# Altium project PCB_Project1.PrjPCB
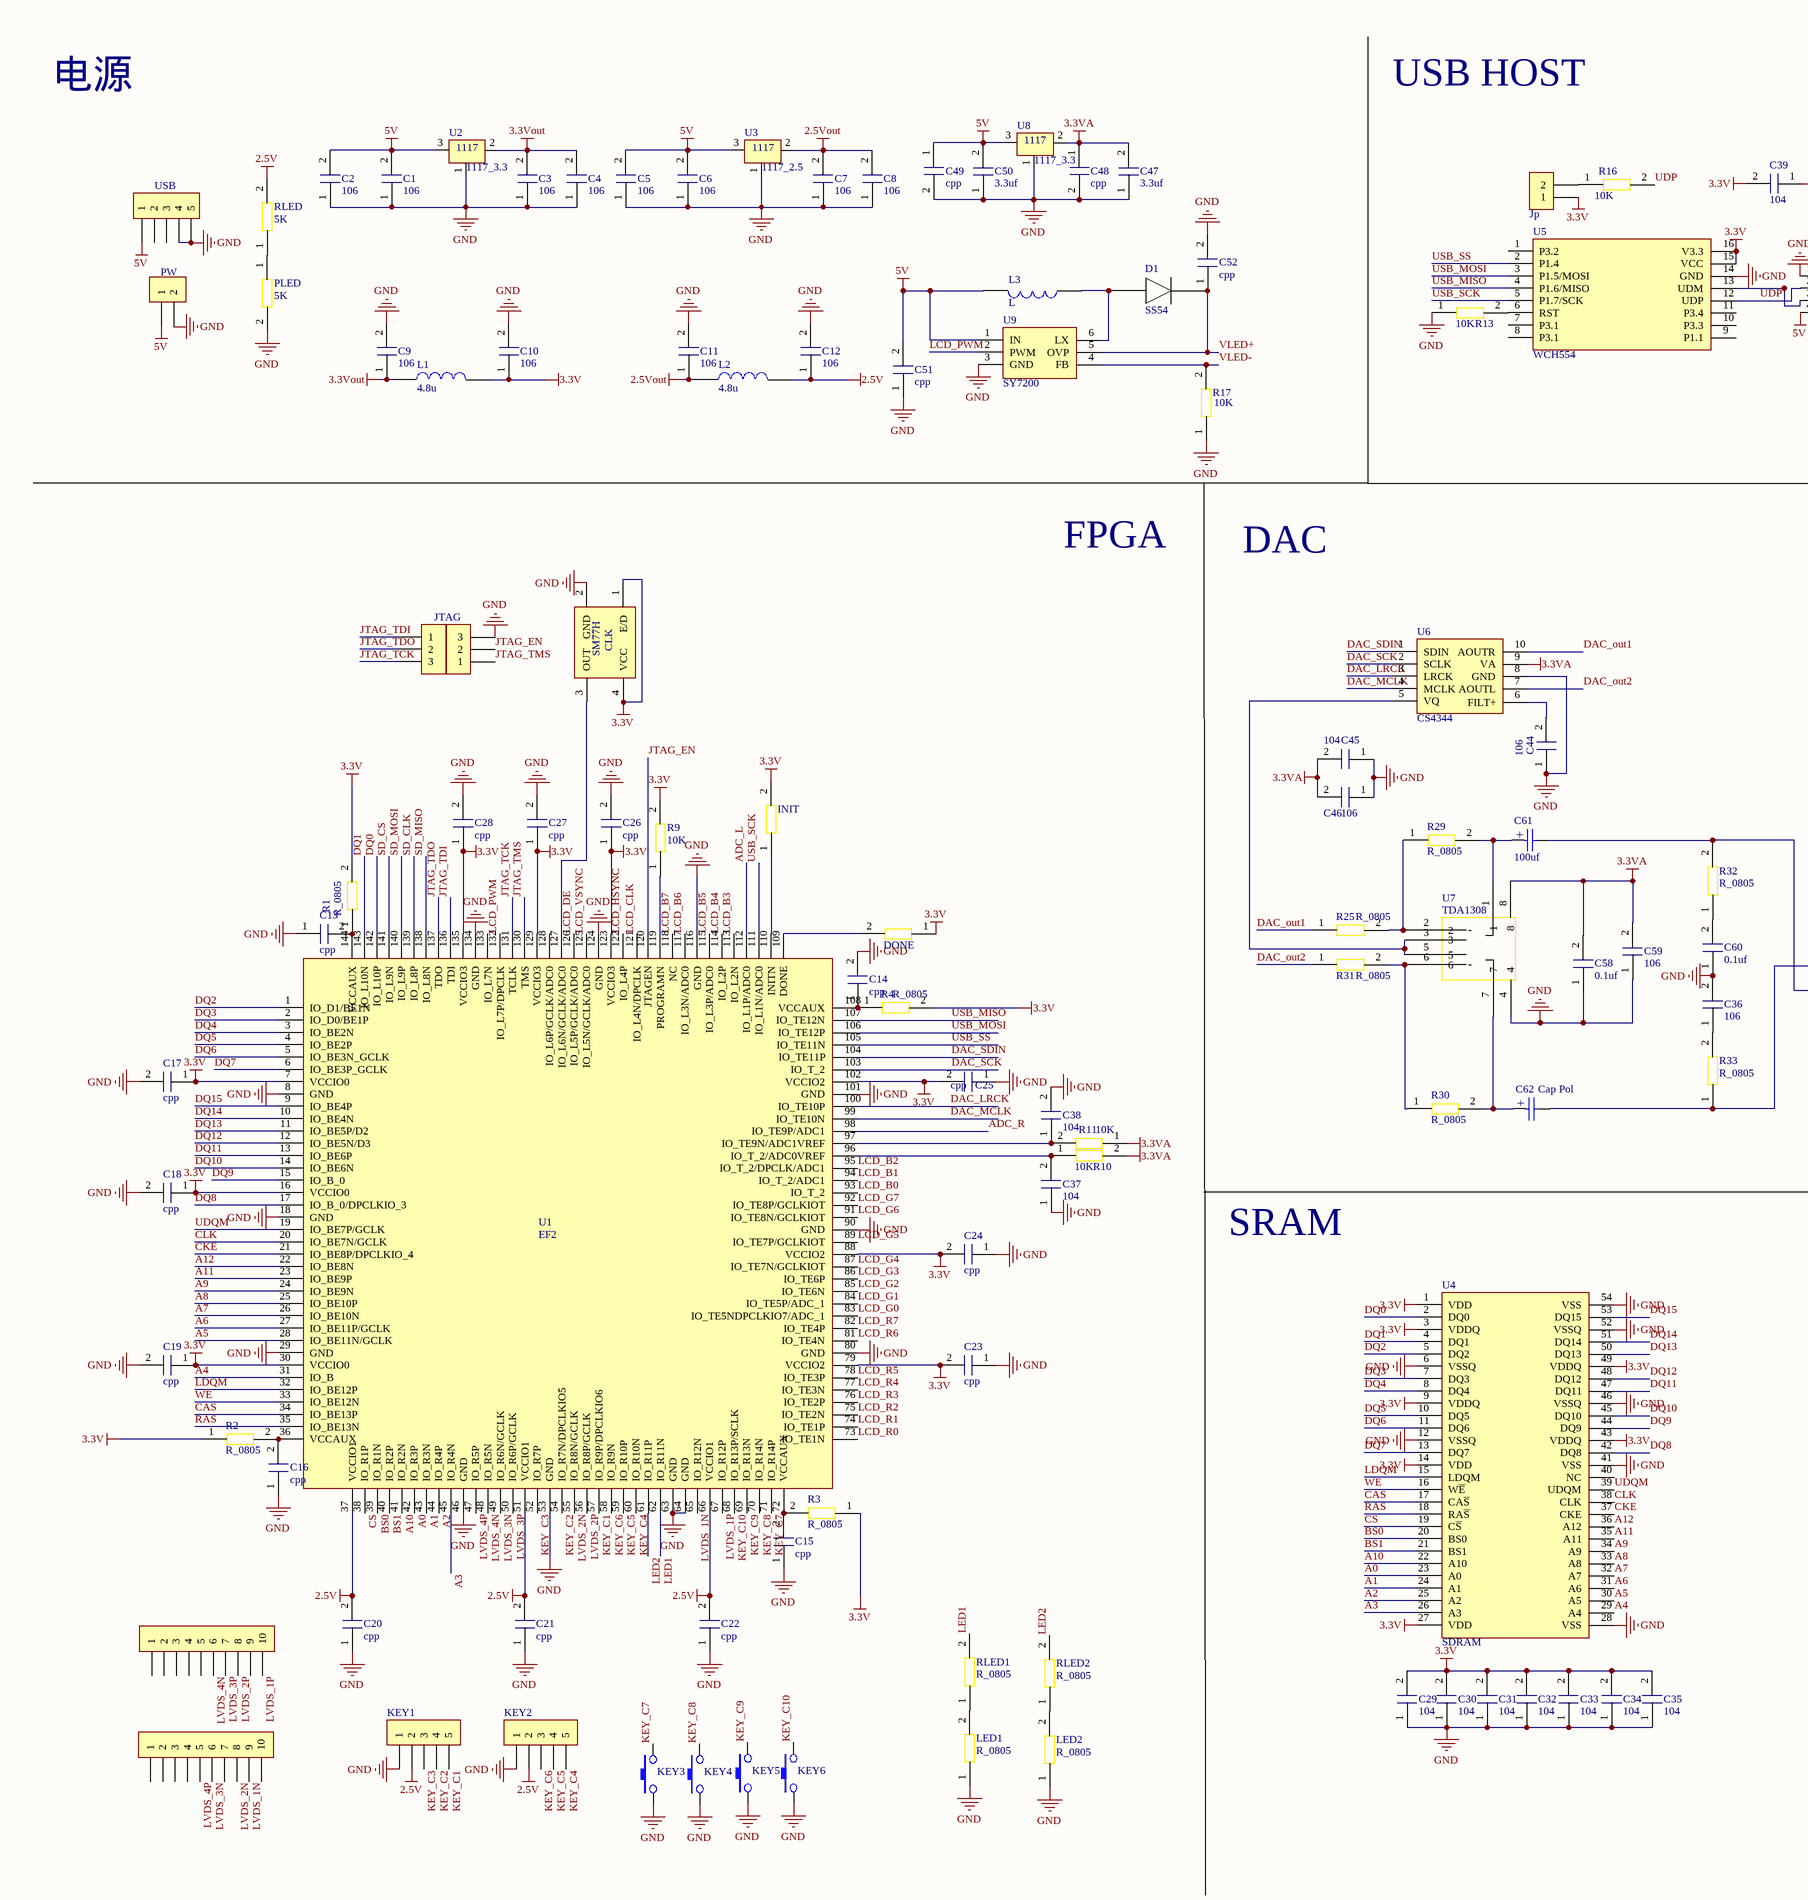
[diagram p0: Sheet1.SchDoc, left]
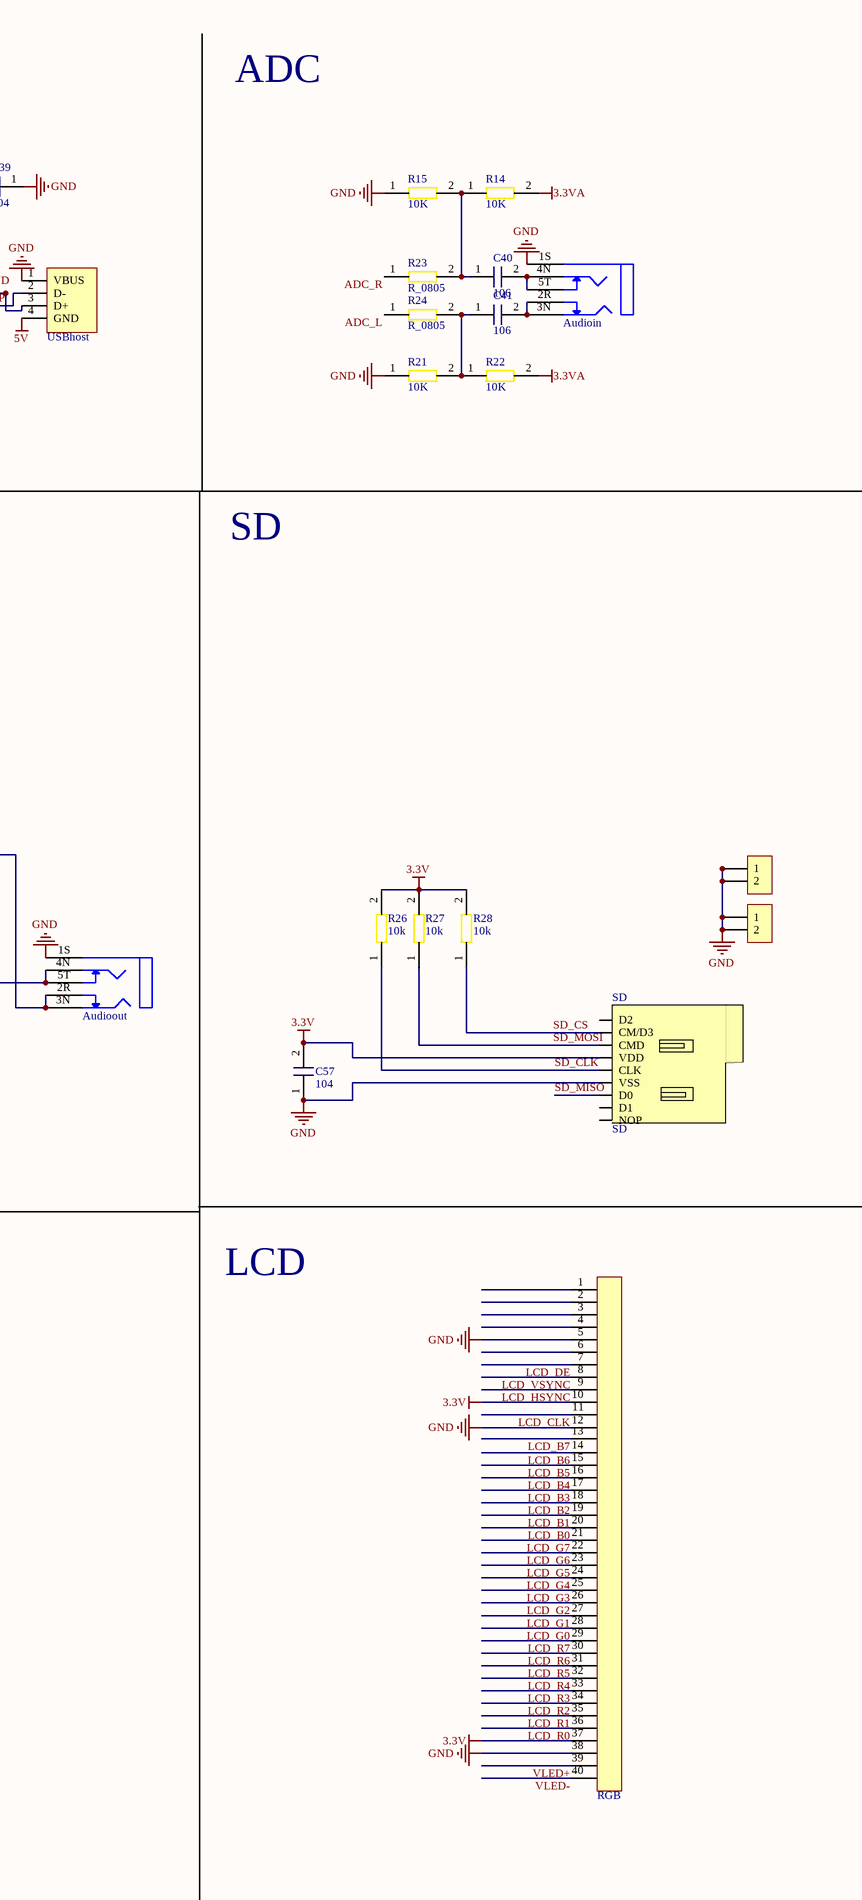
[diagram p1: Sheet1.SchDoc, right]
1 sheet, 123 parts. Net scope: global (net labels, ports and power ports of the same name join across sheets).
Board file: PCB1.PcbDoc

## Sheet Sheet1.SchDoc
size A2

### Parts
Audioin  Audio  [AUDIO]  (value not drawn)
Audioout  Audio  [AUDIO]  (value not drawn)
brg  CON10  [sip10]  (value not drawn)
brg1  CON10  [sip10]  (value not drawn)
brg2  CON2  [SIP2]  (value not drawn)
brg4  CON2  [SIP2]  (value not drawn)
C1  106  [电容器]
C2  106  [电容器]
C3  106  [电容器]
C4  106  [电容器]
C5  106  [电容器]
C6  106  [电容器]
C7  106  [电容器]
C8  106  [电容器]
C9  106  [电容器]
C10  106  [电容器]
C11  106  [电容器]
C12  106  [电容器]
C13  cpp  [电容器]
C14  cpp  [电容器]
C15  cpp  [电容器]
C16  cpp  [电容器]
C17  cpp  [电容器]
C18  cpp  [电容器]
C19  cpp  [电容器]
C20  cpp  [电容器]
C21  cpp  [电容器]
C22  cpp  [电容器]
C23  cpp  [电容器]
C24  cpp  [电容器]
C25  cpp  [电容器]
C26  cpp  [电容器]
C27  cpp  [电容器]
C28  cpp  [电容器]
C29  104  [电容器]
C30  104  [电容器]
C31  104  [电容器]
C32  104  [电容器]
C33  104  [电容器]
C34  104  [电容器]
C35  104  [电容器]
C36  106  [电容器]
C37  104  [电容器]
C38  104  [电容器]
C39  104  [电容器]
C40  106  [电容器]
C41  106  [电容器]
C44  106  [电容器]
C45  104  [电容器]
C46  106  [电容器]
C47  3.3uf  [电容器]
C48  cpp  [电容器]
C49  cpp  [电容器]
C50  3.3uf  [电容器]
C51  cpp  [电容器]
C52  cpp  [电容器]
C57  104  [电容器]
C58  0.1uf  [电容器]
C59  106  [电容器]
C60  0.1uf  [电容器]
C61  100uf  [RB.1/.2]
C62  Cap Pol  [RB.1/.2]
CLK  SM77H  [SM77H]
D1  SS54  [SS54 - duplicate]
DONE  (no value)  [R_0805]
INIT  (no value)  [R_0805]
Jp  CON2  [SIP2]  (value not drawn)
JTAG  CON3  [SIP3]  (value not drawn)
JTAG2  CON3  [SIP3]  (value not drawn)
KEY1  CON5  [SIP5]  (value not drawn)
KEY2  CON5  [SIP5]  (value not drawn)
KEY3  KEY  [AN66]  (value not drawn)
KEY4  KEY  [AN66]  (value not drawn)
KEY5  KEY  [AN66]  (value not drawn)
KEY6  KEY  [AN66]  (value not drawn)
L1  4.8u  [L]
L2  4.8u  [L]
L3  L  [L]
LED1  R_0805  [R_0805]
LED2  R_0805  [R_0805]
PLED  5K  [R_0805]
PW  CON2  [SIP2]  (value not drawn)
R1  R_0805  [R_0805]
R2  R_0805  [R_0805]
R3  R_0805  [R_0805]
R4  R_0805  [R_0805]
R9  10K  [R_0805]
R10  10K  [R_0805]
R11  10K  [R_0805]
R13  10K  [R_0805]
R14  10K  [R_0805]
R15  10K  [R_0805]
R16  10K  [R_0805]
R17  10K  [R_0805]
R21  10K  [R_0805]
R22  10K  [R_0805]
R23  R_0805  [R_0805]
R24  R_0805  [R_0805]
R25  R_0805  [R_0805]
R26  10k  [R_0805]
R27  10k  [R_0805]
R28  10k  [R_0805]
R29  R_0805  [R_0805]
R30  R_0805  [R_0805]
R31  R_0805  [R_0805]
R32  R_0805  [R_0805]
R33  R_0805  [R_0805]
RGB  PFC_40PIN  [FPC_40PIN]  (value not drawn)
RLED  5K  [R_0805]
RLED1  R_0805  [R_0805]
RLED2  R_0805  [R_0805]
SD  SD  [TF卡座]
U1  EF2  [LQFP_EF2]
U2  1117_3.3  [SOT230P700X180-4N]
U3  1117_2.5  [SOT230P700X180-4N]
U4  SDRAM  [SDRAM]
U5  WCH554  [WCH554G]
U6  CS4344  [SSOP10 _CS4344]
U7  TDA1308  [TDA1308]
U8  1117_3.3  [SOT230P700X180-4N]
U9  SY7200  [SOT23-6N]
USB  USB  [micro-USB]  (value not drawn)
USBhost  USBhost  [USB-H]  (value not drawn)

### Nets
2.5V: C12.1(c) C20.2(c+) C21.2(c+) C22.2(c+) KEY1.2 KEY2.2 L2.1 RLED.2 U1.37(VCCIO1) U1.51(VCCIO1) U1.66(VCCIO1)
2.5Vout: C7.2(c+) C8.2(c+) C11.1(c) L2.2 U3.2(OUT)
3.3V: C10.1(c) C17.1(c) C18.1(c) C19.1(c) C23.2(c+) C24.2(c+) C25.2(c+) C26.1(c) C27.1(c) C28.1(c) C29.2(c+) C30.2(c+) C31.2(c+) C32.2(c+) C33.2(c+) C34.2(c+) C35.2(c+) C39.2(c+) C57.2(c+) CLK.1(E/D) CLK.4(VCC) DONE.1 INIT.2 Jp.1 L1.1 R1.2 R2.1 R3.1 R4.2 R9.2 R26.2 R27.2 R28.2 RGB.10 RGB.37 SD.4(VDD) U1.7(VCCIO0) U1.16(VCCIO0) U1.30(VCCIO0) U1.79(VCCIO2) U1.88(VCCIO2) U1.102(VCCIO2) U1.123(VCCIO3) U1.129(VCCIO3) U1.135(VCCIO3) U4.1(VDD) U4.3(VDDQ) U4.9(VDDQ) U4.14(VDD) U4.27(VDD) U4.43(VDDQ) U4.49(VDDQ) U5.15(VCC) U5.16(V3.3)
3.3VA: C45.2(c+) C46.2(c+) C47.2(c+) C48.1(c) C58.2(c+) C59.2(c+) R10.2 R11.1 R14.2 R22.2 U6.9(VA) U7.8 U8.2(OUT)
3.3Vout: C3.2(c+) C4.2(c+) C9.1(c) L1.2 U2.2(OUT)
5V: C1.2(c+) C2.2(c+) C5.2(c+) C6.2(c+) C49.1(c) C50.2(c+) C51.2(c+) L3.1 PW.1 U2.3(IN) U3.3(IN) U8.3(IN) U9.1(IN) USB.1 USBhost.4(GND)
GND: Audioin.1S Audioout.1S brg2.1 brg2.2 brg4.1 brg4.2 C1.1(c) C2.1(c) C3.1(c) C4.1(c) C5.1(c) C6.1(c) C7.1(c) C8.1(c) C9.2(c+) C10.2(c+) C11.2(c+) C12.2(c+) C13.1(c) C14.2(c+) C15.1(c) C16.1(c) C17.2(c+) C18.2(c+) C19.2(c+) C20.1(c) C21.1(c) C22.1(c) C23.1(c) C24.1(c) C25.1(c) C26.2(c+) C27.2(c+) C28.2(c+) C29.1(c) C30.1(c) C31.1(c) C32.1(c) C33.1(c) C34.1(c) C35.1(c) C36.2(c+) C37.1(c) C38.2(c+) C39.1(c) C44.1(c) C45.1(c) C46.1(c) C47.1(c) C48.2(c+) C49.2(c+) C50.1(c) C51.1(c) C52.2(c+) C57.1(c) C58.1(c) C59.1(c) C60.1(c) CLK.2(GND) JTAG2.3 KEY1.1 KEY2.1 KEY3.1 KEY4.1 KEY5.1 KEY6.1 LED1.1 LED2.1 PLED.2 PW.2 R13.1 R15.1 R17.1 R21.1 RGB.5 RGB.12 RGB.38 SD.6(VSS) U1.8(GND) U1.18(GND) U1.29(GND) U1.46(GND) U1.53(GND) U1.63(GND) U1.64(GND) U1.80(GND) U1.90(GND) U1.101(GND) U1.116(GND) U1.124(GND) U1.134(GND) U2.1(ADJ) U3.1(ADJ) U4.6(VSSQ) U4.12(VSSQ) U4.28(VSS) U4.41(VSS) U4.46(VSSQ) U4.52(VSSQ) U4.54(VSS) U5.14(GND) U6.8(GND) U7.4 U8.1(ADJ) U9.3(GND) USB.4 USB.5 USBhost.1(VBUS)
A0: U1.42(IO_R3P) U4.23(A0)
A1: U1.43(IO_R3N) U4.24(A1)
A2: U1.44(IO_R4P) U4.25(A2)
A3: U1.45(IO_R4N) U4.26(A3)
A4: U1.31(IO_B) U4.29(A4)
A5: U1.28(IO_BE11N/GCLK) U4.30(A5)
A6: U1.27(IO_BE11P/GCLK) U4.31(A6)
A7: U1.26(IO_BE10N) U4.32(A7)
A8: U1.25(IO_BE10P) U4.33(A8)
A9: U1.24(IO_BE9N) U4.34(A9)
A10: U1.41(IO_R2N) U4.22(A10)
A11: U1.23(IO_BE9P) U4.35(A11)
A12: U1.22(IO_BE8N) U4.36(A12)
ADC_L: R24.1 U1.112(IO_L1P/ADC0)
ADC_R: R23.1 U1.98(IO_TE9P/ADC1)
BS0: U1.39(IO_R1N) U4.20(BS0)
BS1: U1.40(IO_R2P) U4.21(BS1)
CAS: U1.34(IO_BE13P) U4.17(CA~{S})
CKE: U1.21(IO_BE8P/DPCLKIO_4) U4.37(CKE)
CLK: U1.20(IO_BE7N/GCLK) U4.38(CLK)
CS: U1.38(IO_R1P) U4.19(C~{S})
DAC_LRCK: U1.100(IO_TE10P) U6.3(LRCK)
DAC_MCLK: U1.99(IO_TE10N) U6.4(MCLK)
DAC_out1: R25.1 U6.10(AOUTR)
DAC_out2: R31.1 U6.7(AOUTL)
DAC_SCK: U1.103(IO_T_2) U6.2(SCLK)
DAC_SDIN: U1.104(IO_TE11P) U6.1(SDIN)
DQ0: U1.142(IO_L10P) U4.2(DQ0)
DQ1: U1.143(IO_L10N) U4.4(DQ1)
DQ2: U1.1(IO_D1/BE1N) U4.5(DQ2)
DQ3: U1.2(IO_D0/BE1P) U4.7(DQ3)
DQ4: U1.3(IO_BE2N) U4.8(DQ4)
DQ5: U1.4(IO_BE2P) U4.10(DQ5)
DQ6: U1.5(IO_BE3N_GCLK) U4.11(DQ6)
DQ7: U1.6(IO_BE3P_GCLK) U4.13(DQ7)
DQ8: U1.17(IO_B_0/DPCLKIO_3) U4.42(DQ8)
DQ9: U1.15(IO_B_0) U4.44(DQ9)
DQ10: U1.14(IO_BE6N) U4.45(DQ10)
DQ11: U1.13(IO_BE6P) U4.47(DQ11)
DQ12: U1.12(IO_BE5N/D3) U4.48(DQ12)
DQ13: U1.11(IO_BE5P/D2) U4.50(DQ13)
DQ14: U1.10(IO_BE4N) U4.51(DQ14)
DQ15: U1.9(IO_BE4P) U4.53(DQ15)
JTAG_EN: JTAG2.2 U1.120(JTAGEN)
JTAG_TCK: JTAG.3 U1.131(TCLK)
JTAG_TDI: JTAG.1 U1.136(TDI)
JTAG_TDO: JTAG.2 U1.137(TDO)
JTAG_TMS: JTAG2.1 U1.130(TMS)
KEY_C1: KEY1.5 U1.57(IO_R9P/DPCLKIO6)
KEY_C2: KEY1.4 U1.54(IO_R7N/DPCLKIO5)
KEY_C3: KEY1.3 U1.52(IO_R7P)
KEY_C4: KEY2.5 U1.60(IO_R10N)
KEY_C5: KEY2.4 U1.59(IO_R10P)
KEY_C6: KEY2.3 U1.58(IO_R9N)
KEY_C7: KEY3.2 U1.71(IO_R14P)
KEY_C8: KEY4.2 U1.70(IO_R14N)
KEY_C9: KEY5.2 U1.69(IO_R13N)
KEY_C10: KEY6.2 U1.68(IO_R13P/SCLK)
LCD_B0: RGB.20 U1.93(IO_T_2)
LCD_B1: RGB.19 U1.94(IO_T_2/ADC1)
LCD_B2: RGB.18 U1.95(IO_T_2/DPCLK/ADC1)
LCD_B3: RGB.17 U1.113(IO_L2N)
LCD_B4: RGB.16 U1.114(IO_L2P)
LCD_B5: RGB.15 U1.115(IO_L3P/ADC0)
LCD_B6: RGB.14 U1.117(IO_L3N/ADC0)
LCD_B7: RGB.13 U1.118(NC)
LCD_CLK: RGB.11 U1.121(IO_L4N/DPCLK)
LCD_DE: RGB.7 U1.126(IO_L5P/GCLK/ADC0)
LCD_G0: RGB.28 U1.83(IO_TE5NDPCLKIO7/ADC_1)
LCD_G1: RGB.27 U1.84(IO_TE5P/ADC_1)
LCD_G2: RGB.26 U1.85(IO_TE6N)
LCD_G3: RGB.25 U1.86(IO_TE6P)
LCD_G4: RGB.24 U1.87(IO_TE7N/GCLKIOT)
LCD_G5: RGB.23 U1.89(IO_TE7P/GCLKIOT)
LCD_G6: RGB.22 U1.91(IO_TE8N/GCLKIOT)
LCD_G7: RGB.21 U1.92(IO_TE8P/GCLKIOT)
LCD_HSYNC: RGB.9 U1.122(IO_L4P)
LCD_PWM: U1.132(IO_L7P/DPCLK) U9.2(PWM)
LCD_R0: RGB.36 U1.73(IO_TE1N)
LCD_R1: RGB.35 U1.74(IO_TE1P)
LCD_R2: RGB.34 U1.75(IO_TE2N)
LCD_R3: RGB.33 U1.76(IO_TE2P)
LCD_R4: RGB.32 U1.77(IO_TE3N)
LCD_R5: RGB.31 U1.78(IO_TE3P)
LCD_R6: RGB.30 U1.81(IO_TE4N)
LCD_R7: RGB.29 U1.82(IO_TE4P)
LCD_VSYNC: RGB.8 U1.125(IO_L5N/GCLK/ADC0)
LDQM: U1.32(IO_BE12P) U4.15(LDQM)
LED1: RLED1.2 U1.62(IO_R11N)
LED2: RLED2.2 U1.61(IO_R11P)
LVDS_1N: brg1.9 U1.65(IO_R12N)
LVDS_1P: brg.10 U1.67(IO_R12P)
LVDS_2N: brg1.8 U1.55(IO_R8N/GCLK)
LVDS_2P: brg.8 U1.56(IO_R8P/GCLK)
LVDS_3N: brg1.6 U1.49(IO_R6N/GCLK)
LVDS_3P: brg.7 U1.50(IO_R6P/GCLK)
LVDS_4N: brg.6 U1.48(IO_R5N)
LVDS_4P: brg1.5 U1.47(IO_R5P)
RAS: U1.35(IO_BE13N) U4.18(RA~{S})
SD_CLK: R26.1 SD.5(CLK) U1.139(IO_L8P)
SD_CS: R28.1 SD.2(CM/D3) U1.141(IO_L9N)
SD_MISO: SD.7(D0) U1.138(IO_L8N)
SD_MOSI: R27.1 SD.3(CMD) U1.140(IO_L9P)
UDP: R16.2 U5.12(UDP) USBhost.2(D-)
UDQM: U1.19(IO_BE7P/GCLK) U4.39(UDQM)
USB_MISO: U1.107(IO_TE12N) U5.4(P1.6/MISO)
USB_MOSI: U1.106(IO_TE12P) U5.3(P1.5/MOSI)
USB_SCK: U1.111(IO_L1N/ADC0) U5.5(P1.7/SCK)
USB_SS: U1.105(IO_TE11N) U5.2(P1.4)
VLED+: C52.1(c) D1.1 RGB.39 U9.5(OVP)
VLED-: R17.2 RGB.40 U9.4(FB)
WE: U1.33(IO_BE12N) U4.16(W~{E})
NetAudioin_2R: Audioin.2R Audioin.3N C41.2(c+)
NetAudioin_4N: Audioin.4N Audioin.5T C40.2(c+)
NetAudioout_2R: Audioout.2R Audioout.3N C61.2 R32.2
NetAudioout_4N: Audioout.4N Audioout.5T C62.2 R33.1
NetC13_2: C13.2(c+) R1.1 U1.144(VCCAUX)
NetC14_1: C14.1(c) R4.1 U1.108(VCCAUX)
NetC15_2: C15.2(c+) R3.2 U1.72(VCCAUX)
NetC16_2: C16.2(c+) R2.2 U1.36(VCCAUX)
NetC36_1: C36.1(c) R33.2
NetC37_2: C37.2(c+) R10.1 U1.96(IO_T_2/ADC0VREF)
NetC38_1: C38.1(c) R11.2 U1.97(IO_TE9N/ADC1VREF)
NetC40_1: C40.1(c) R14.1 R15.2 R23.2
NetC41_1: C41.1(c) R21.2 R22.1 R24.2
NetC44_2: C44.2(c+) U6.6(FILT+)
NetC60_2: C60.2(c+) R32.1
NetC61_1: C61.1 R29.2 U7.1
NetC62_1: C62.1 R30.2 U7.7
NetCLK_3: CLK.3(OUT) U1.127(IO_L6N/GCLK/ADC0)
NetD1_2: D1.2 L3.2 U9.6(LX)
NetDONE_2: DONE.2 U1.109(DONE)
NetINIT_1: INIT.1 U1.110(INITN)
NetJp_2: Jp.2 R16.1
NetLED1_2: LED1.2 RLED1.1
NetLED2_2: LED2.2 RLED2.1
NetPLED_1: PLED.1 RLED.1
NetR9_1: R9.1 U1.119(PROGRAMN)
NetR13_2: R13.2 U5.6(RST)
NetR25_2: R25.2 R29.1 U7.2
NetR30_1: R30.1 R31.2 U7.6
NetU5_13: U5.13(UDM) USBhost.3(D+)
NetU6_5: U6.5(VQ) U7.3 U7.5

Not connected (* = marked no-connect by the designer): brg 1 2 3 4 5 9; brg1 1 2 3 4 7 10; RGB 1 2 3 4 6; SD 1(D2) 8(D1) 9(NOP); U1 128(IO_L6P/GCLK/ADC0) 133(IO_L7N); U4 40(NC); U5 1(P3.2) 7(P3.1) 8(P3.1) 9(P1.1) 10(P3.3) 11(P3.4); USB 2 3

### Notes on the sheet
- 电源
- USB HOST
- ADC
- SD
- FPGA
- DAC
- SRAM
- LCD
- (in symbol Cap Pol) +

### Library data of the parts
C1-C12 C29-C41 C44-C47 C50 C57-C60 = cpp
C61 = Cap Pol
DONE INIT PLED R9-R11 R13-R17 R21 R22 R26-R28 RLED = R_0805
L1 L2 = L
SD = TF卡座
U2 U3 U8 = 1117